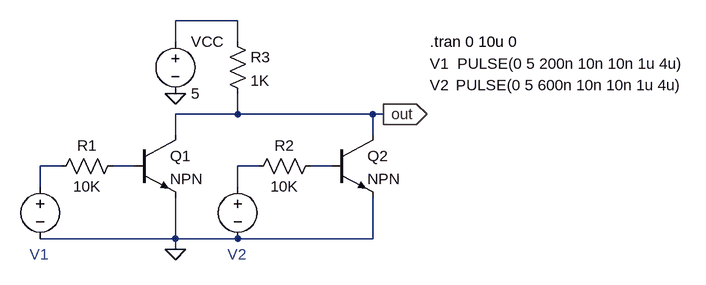
[diagram p0: schematic nor_gate_rtl.asc]
nor_gate_rtl.asc, the LTspice schematic file:
Version 4.1
SHEET 1 1032 680
WIRE 320 -80 224 -80
WIRE 224 -48 224 -80
WIRE 320 -48 320 -80
WIRE 320 64 320 32
WIRE 320 64 224 64
WIRE 528 64 320 64
WIRE 544 64 528 64
WIRE 224 96 224 64
WIRE 528 96 528 64
WIRE 48 144 16 144
WIRE 160 144 128 144
WIRE 352 144 320 144
WIRE 464 144 432 144
WIRE 16 176 16 144
WIRE 320 176 320 144
WIRE 224 256 224 192
WIRE 224 256 16 256
WIRE 320 256 224 256
WIRE 528 256 528 192
WIRE 528 256 320 256
WIRE 224 272 224 256
FLAG 224 32 0
FLAG 544 64 out
IOPIN 544 64 Out
FLAG 224 272 0
SYMBOL res 144 128 R90
WINDOW 0 0 56 VBottom 2
WINDOW 3 32 56 VTop 2
SYMATTR InstName R1
SYMATTR Value 10K
SYMBOL voltage 16 160 R0
WINDOW 0 600 -174 Left 2
WINDOW 3 642 -174 Left 2
WINDOW 123 0 0 Left 0
WINDOW 39 0 0 Left 0
SYMATTR InstName V1
SYMATTR Value PULSE(0 5 200n 10n 10n 1u 4u)
SYMBOL npn 160 96 R0
SYMATTR InstName Q1
SYMBOL voltage 320 160 R0
WINDOW 0 296 -141 Left 2
WINDOW 3 336 -141 Left 2
WINDOW 123 0 0 Left 0
WINDOW 39 0 0 Left 0
SYMATTR InstName V2
SYMATTR Value PULSE(0 5 600n 10n 10n 1u 4u)
SYMBOL res 448 128 R90
WINDOW 0 0 56 VBottom 2
WINDOW 3 32 56 VTop 2
SYMATTR InstName R2
SYMATTR Value 10K
SYMBOL npn 464 96 R0
SYMATTR InstName Q2
SYMBOL res 304 -64 R0
SYMATTR InstName R3
SYMATTR Value 1K
SYMBOL voltage 224 -64 R0
SYMATTR InstName VCC
SYMATTR Value 5
TEXT 616 -48 Left 2 !.tran 0 10u 0
TEXT 0 280 Left 2 ;V1
TEXT 304 280 Left 2 ;V2

The netlist it stands for:
* nor_gate_rtl.asc
R1 N003 N002 10K
V1 N002 0 PULSE(0 5 200n 10n 10n 1u 4u)
Q1 out N003 0 0 NPN
V2 N004 0 PULSE(0 5 600n 10n 10n 1u 4u)
R2 N005 N004 10K
Q2 out N005 0 0 NPN
R3 N001 out 1K
VCC N001 0 5
.model NPN NPN
.model PNP PNP
.lib standard.bjt
.tran 0 10u 0
* V1
* V2
.backanno
.end